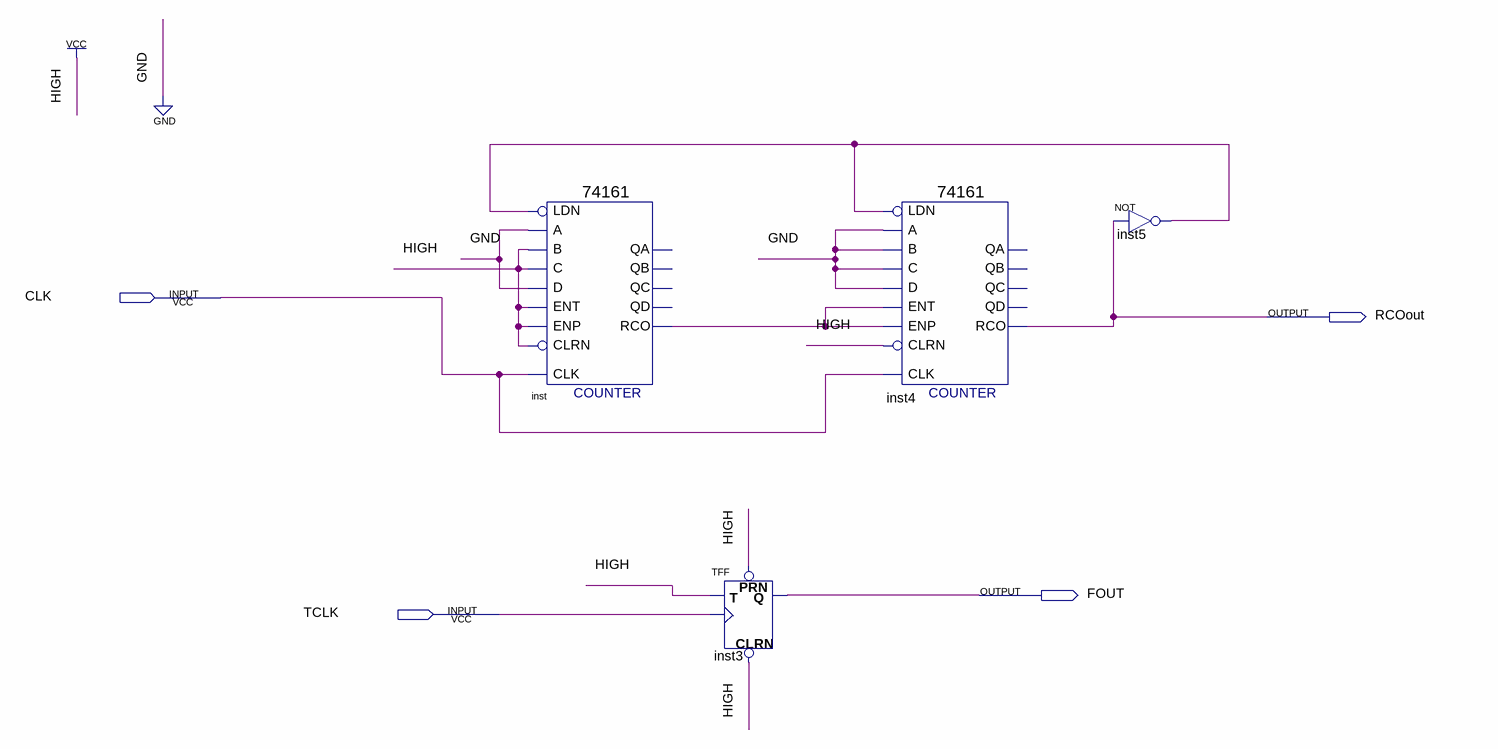
[diagram p0: schematic sheet]
// Quartus schematic frequencyDivider.bdf as structural Verilog: 4 symbols, 4 pins
module frequencyDivider (
  input  CLK,
  input  TCLK,
  output RCOout,
  output FOUT
);

  wire inst5_out, inst_rco;

  \74161  inst (
    .CLRN(1'b1), .CLK(CLK), .ENP(1'b1), .LDN(inst5_out), .A(1'b0), .D(1'b0), .ENT(1'b1), .B(1'b1), .C(1'b1),
    .RCO(inst_rco));  // open: QD, QC, QB, QA
  TFF inst3 (.PRN(1'b1), .CLRN(1'b1), .T(1'b1), .CLK(TCLK), .Q(FOUT));
  \74161  inst4 (
    .CLRN(1'b1), .CLK(CLK), .ENP(inst_rco), .LDN(inst5_out), .A(1'b0), .D(1'b0), .ENT(inst_rco), .B(1'b0),
    .C(1'b0), .RCO(RCOout));  // open: QD, QC, QB, QA
  not inst5 (inst5_out, RCOout);
endmodule
